# Altium schematic sheet thrust_sensors.SchDoc
size A; SheetNumber: 2; SheetTotal: 3
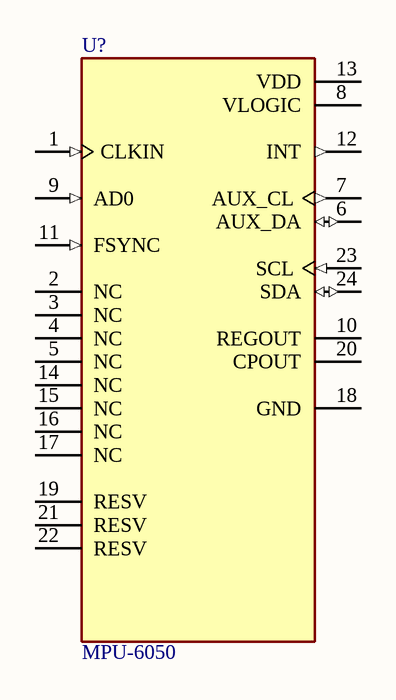
[diagram p0: thrust_sensors.SchDoc]

## Parts
U?  MPU-6050  [QFN50P400X400X95-24N]

## Nets

Not connected (* = marked no-connect by the designer): U? 1(CLKIN) 2(NC) 3(NC) 4(NC) 5(NC) 6(AUX_DA) 7(AUX_CL) 8(VLOGIC) 9(AD0) 10(REGOUT) 11(FSYNC) 12(INT) 13(VDD) 14(NC) 15(NC) 16(NC) 17(NC) 18(GND) 19(RESV) 20(CPOUT) 21(RESV) 22(RESV) 23(SCL) 24(SDA)

## Library data of the parts
U? = MPU-6050: MPU-6050 series Accelerometer, Gyroscope, 3 Axis Sensor Evaluation Board; MF: TDK InvenSense; SnapEDA_Link: https://www.snapeda.com/parts/MPU-6050/TDK+InvenSense/view-part/?ref=snap; Package: QFN-24 InvenSense; Value: *; MP: MPU-6050; Check_prices: https://www.snapeda.com/parts/MPU-6050/TDK+InvenSense/view-part/?ref=eda; LCSC Part Number: C5445394